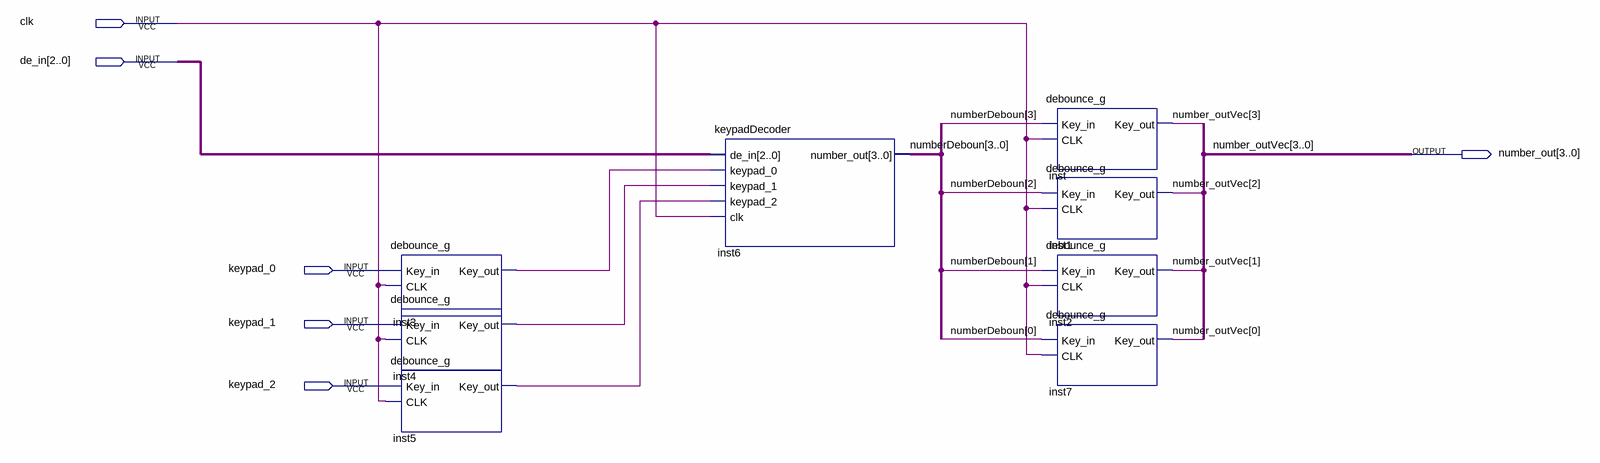
[diagram p0: schematic sheet]
// Quartus schematic keypadDecoderWithdebounce.bdf as structural Verilog: 8 symbols, 6 pins
module keypadDecoderWithdebounce (
  input  clk,
  input  [2:0] de_in,
  input  keypad_0,
  input  keypad_1,
  input  keypad_2,
  output [3:0] number_out
);

  wire inst3_key_out, inst4_key_out, inst5_key_out;
  wire [3:0] numberDeboun;

  debounce_g inst3 (.Key_in(keypad_0), .CLK(clk), .Key_out(inst3_key_out));
  debounce_g inst4 (.Key_in(keypad_1), .CLK(clk), .Key_out(inst4_key_out));
  debounce_g inst5 (.Key_in(keypad_2), .CLK(clk), .Key_out(inst5_key_out));
  keypadDecoder inst6 (
    .de_in(de_in), .keypad_0(inst3_key_out), .keypad_1(inst4_key_out), .keypad_2(inst5_key_out), .clk(clk),
    .number_out(numberDeboun));
  debounce_g inst (.Key_in(numberDeboun[3]), .CLK(clk), .Key_out(number_out[3]));
  debounce_g inst1 (.Key_in(numberDeboun[2]), .CLK(clk), .Key_out(number_out[2]));
  debounce_g inst2 (.Key_in(numberDeboun[1]), .CLK(clk), .Key_out(number_out[1]));
  debounce_g inst7 (.Key_in(numberDeboun[0]), .CLK(clk), .Key_out(number_out[0]));

  // Other names for the same wires on the sheet: number_outVec[3:0] = number_out
endmodule
